# Altium schematic sheet power input.SchDoc
size 431 x 279 mm; SheetNumber: 4; SheetTotal: 5
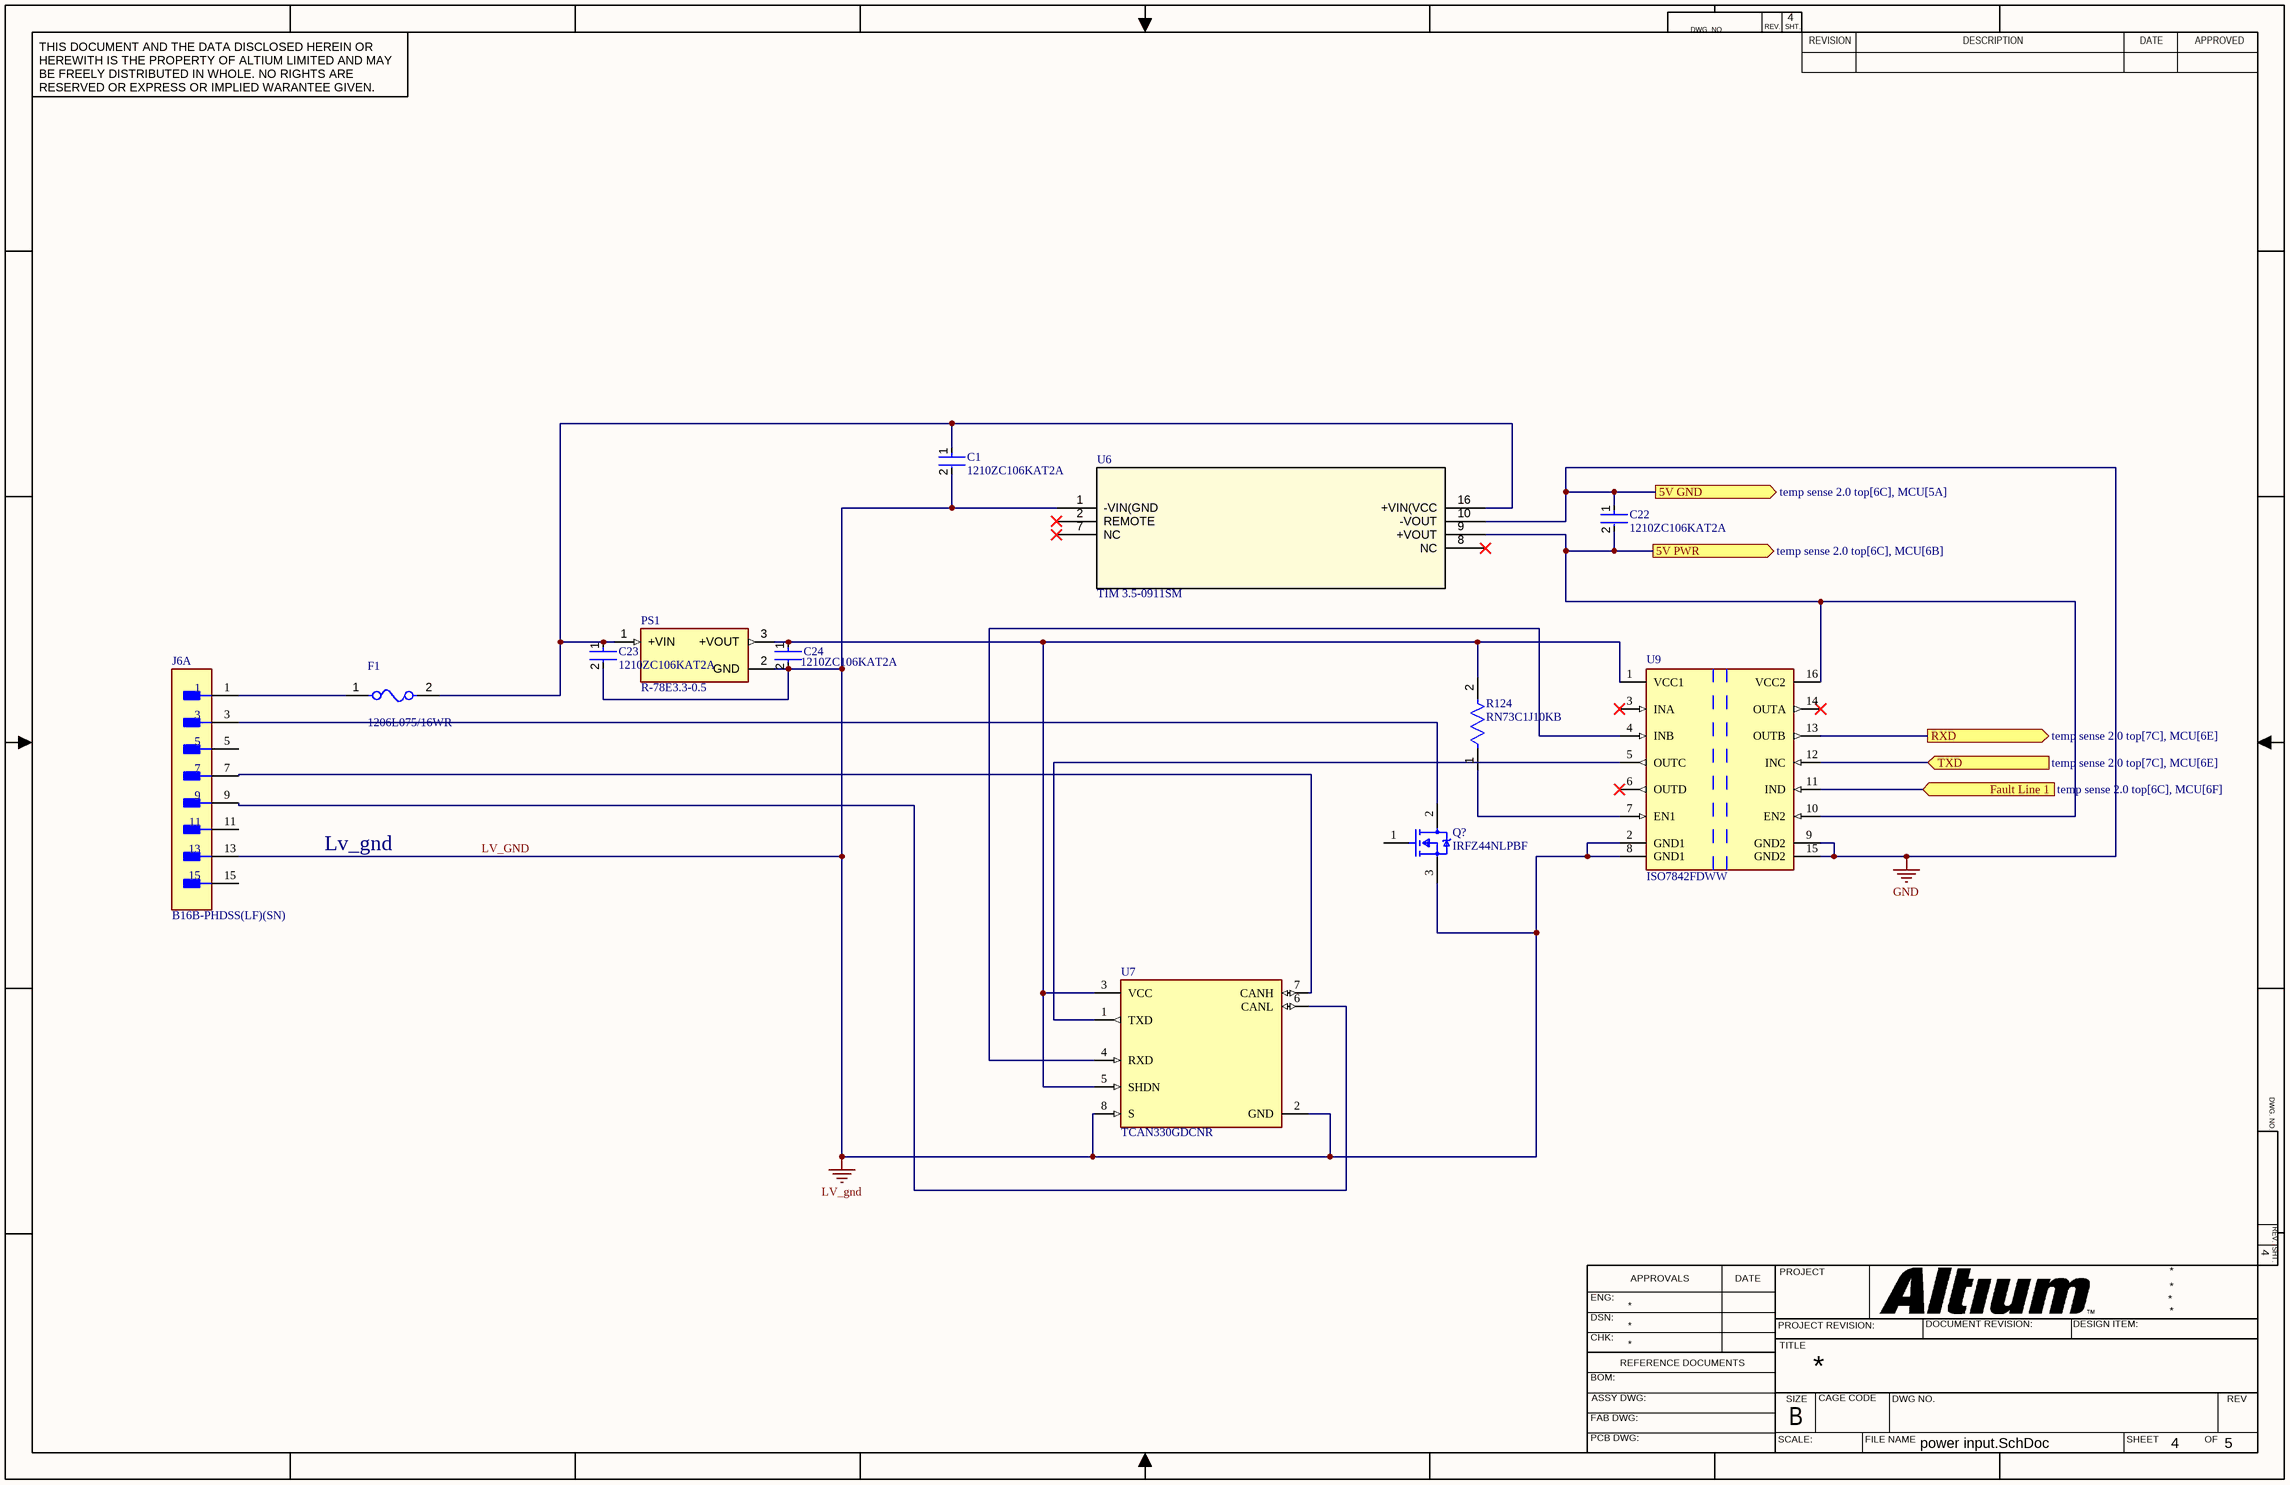
[diagram p0: power input.SchDoc]

## Parts
C1  1210ZC106KAT2A  [FP-1210-L_3_3_0_4-W_2_5_0-IPC_A]
C22  1210ZC106KAT2A  [FP-1210-L_3_3_0_4-W_2_5_0-IPC_A]
C23  1210ZC106KAT2A  [FP-1210-L_3_3_0_4-W_2_5_0-IPC_A]
C24  1210ZC106KAT2A  [FP-1210-L_3_3_0_4-W_2_5_0-IPC_A]
F1  1206L075/16WR  [FP-1206L-MFG]
J6  B16B-PHDSS(LF)(SN)  [FP-B16B-PHDSS_LF_SN-MFG]  (part A of 2)
PS1  R-78E3.3-0.5  [CONV_R-78E3.3-0.5]
Q?  IRFZ44NLPBF  [FP-PG-TO262-3-MFG]
R124  RN73C1J10KB  [FP-RN731J-MFG]
U6  TIM 3.5-0911SM  [TIM 3.5SM SINGLE_TRP]
U7  TCAN330GDCNR  [FP-DCN0008A-MFG]
U9  ISO7842FDWW  [FP-DWW0016A-MFG]

## Ports
5V GND (out, see temp sense 2.0 top[6C], MCU[5A]), 5V PWR (out, see temp sense 2.0 top[6C], MCU[6B]), Fault Line 1 (in, see temp sense 2.0 top[6C], MCU[6F]), RXD (out, see temp sense 2.0 top[7C], MCU[6E]), TXD (in, see temp sense 2.0 top[7C], MCU[6E])

## Nets
GND: C22.1 U6.10(-VOUT) U9.9(GND2) U9.15(GND2) ; port 5V GND
LV_GND: C1.2 C23.2 C24.2 J6.13 PS1.2(GND) Q?.3(S) U6.1(-VIN(GND) U7.2(GND) U7.8(S) U9.2(GND1) U9.8(GND1)
5V PWR: C22.2 U6.9(+VOUT) U9.10(EN2) U9.16(VCC2) ; port 5V PWR
Fault Line 1: U9.11(IND) ; port Fault Line 1
RXD: U9.13(OUTB) ; port RXD
TXD: U9.12(INC) ; port TXD
NetC1_1: C1.1 C23.1 F1.2 PS1.1(+VIN) U6.16(+VIN(VCC)
NetC24_1: C24.1 PS1.3(+VOUT) R124.2 U7.3(VCC) U7.5(SHDN) U9.1(VCC1)
NetF1_1: F1.1 J6.1
NetJ6_3: J6.3 Q?.2(D)
NetJ6_7: J6.7 U7.7(CANH)
NetJ6_9: J6.9 U7.6(CANL)
NetR124_1: R124.1 U9.7(EN1)
NetU7_1: U7.1(TXD) U9.5(OUTC)
NetU7_4: U7.4(RXD) U9.4(INB)

Not connected (* = marked no-connect by the designer): J6 5 11 15; Q? 1(G); U6 2(REMOTE)* 7(NC)* 8(NC)*; U9 3(INA)* 6(OUTD)* 14(OUTA)*

## Notes on the sheet
- Lv_gnd
- DWG. NO.
- REV.
- SHT.
- THIS DOCUMENT AND THE DATA DISCLOSED HEREIN OR HEREWITH IS THE PROPERTY OF ALTIUM LIMITED AND MAY BE FREELY DISTRIBUTED IN WHOLE. NO RIGHTS ARE RESERVED OR EXPRESS OR IMPLIED WARANTEE GIVEN.
- REVISION
- DESCRIPTION
- DATE
- APPROVED
- ENG:
- APPROVALS
- PROJECT
- DSN:
- CHK:
- REFERENCE DOCUMENTS
- PROJECT REVISION:
- TITLE
- DOCUMENT REVISION:
- DESIGN ITEM:
- BOM:
- FAB DWG:
- PCB DWG:
- ASSY DWG:
- SCALE:
- SIZE
- B
- CAGE CODE
- FILE NAME
- DWG NO.
- SHEET
- OF
- REV

## Library data of the parts
C1 C22-C24 = CMP-1038-02198-3: CAP CER 10UF 10V X7R 1210; Dissipation Factor: 5%; Tolerance: 10%; Capacitance: 10uF; Voltage Rating (DC): 10V; Case Code (Imperial): 1210; Termination: SMD/SMT; Min Operating Temperature: -55°C; Max Operating Temperature: 125°C; Voltage: 10V; RoHS Compliant: Yes; Lead Free: Lead Free; Construction: Flat; Case/Package: 1210; Dielectric: X7R; Width: 0.098inch; REACH SVHC: No SVHC; Mount: Surface Mount; Case Code (Metric): 3225; Depth: 2.5mm; Series: 1210; Voltage Rating: 10V; Packaging: Tape and Reel; Length: 3.2mm; Thickness: 0.11inch; Package Quantity: 1; Height: 2.79mm; Radiation Hardening: No
F1 = CMP-08606-000003-1: PTC RESET FUSE 16V 750MA 1206; Manufacturer: Littelfuse Inc; Hold Current: 0.75A; Resistance: 0.09-0.29Ω; Value: 0.09-0.29Ω; Trip Time: 0.2s; Current Rating: 100A; Trip Current: 1.5A; Device Class L2: PTC Resettable Fuses; RoHS: TRUE; Temperature: -40°C to +85°C; ComponentLink2URL: https://www.littelfuse.com/~/media/electronics/datasheets/resettable_ptcs/littelfuse_ptc_1206l_datasheet.pdf.pdf; Voltage Rating: 16V; Category: Fuse; Manufacturer Part Number: 1206L075/16WR; Lead Free: Yes; Digikey Description: PTC RESET FUSE 16V 750MA 1206; Temperature Range Low: -40°C; Temperature Range High: +85°C; Octopart: https://octopart.com/1206l075%2F16wr-littelfuse-28867102; Package: 1206L; Device Class L1: Circuit Protection; Height: 1.25mm; ComponentLink2Description: Datasheet; Automotive: No; Mouser Description: Resettable Fuses - PPTC 16V 0.75A 1206 PTC; Device Class L3: unset
J6 = CMP-17439-000399-1: CONN HEADER VERT 16POS 2MM; Max Current Rating: 3A; Voltage Rating: 250V; Row Spacing: 0.079inch; Number of Contacts: 16; Mated Stacking Heights: 8.8mm; Contact Resistance: 20mR; Gender: Male; Contact Finish - Mating: TIN; Contact Mating Length: 0.114inch; Current Rating: 3A; Connector Type: Header; Insulation Material: Nylon; Packaging: Bulk; Max Voltage Rating (AC): 250V; Depth: 5mm; Number of Rows: 2; Length: 17.9mm; Width: 5mm; Mount: Through Hole; Contact Material: Copper Alloy; Pitch: 2mm; Insulation Color: Natural; Lead Free: Lead Free; Housing Material: Polyamide; Min Operating Temperature: -25°C; Max Operating Temperature: 85°C; Contact Type: Male Pin; Fastening Type: Detent; Height: 9.5mm; Color: Natural; Contact Shape: Square; Housing Color: Beige; Series: PHD; Number of Positions: 16; Orientation: Straight; Flammability Rating: UL94 V-0; Termination: Solder; Contact Plating: Copper
PS1 = R-78E3.3-0.5: 0.5A DC/DC-Converter 'INNOLINE' SIP3 reg; MF: Recom Power; Check_prices: https://www.snapeda.com/parts/R-78E3.3-0.5/Recom+Power/view-part/?ref=eda; Value: *; MP: R-78E3.3-0.5; Purchase-URL: https://pricing.snapeda.com/search/part/R-78E3.3-0.5/?ref=eda; SnapEDA_Link: https://www.snapeda.com/parts/R-78E3.3-0.5/Recom+Power/view-part/?ref=snap; Package: SIP-3 Recom Power; Digi-Key_Part_Number: 945-1661-5-ND
Q? = CMP-00196-65874408-1: IRFZ44NLPBF Single N-Channel 55 V 17.5 mOhm 63 nC HEXFET® Power Mosfet - TO-262; Resistance: 17.5MΩ; Turn-On Delay Time: 12ns; Drain to Source Breakdown Voltage: 55V; Threshold Voltage: 4V; Rise Time: 60ns; Input Capacitance: 1.47nF; Power Dissipation: 110W; Max Junction Temperature (Tj): 175°C; Gate to Source Voltage (Vgs): 20V; Number of Channels: 1; Fall Time: 45ns; Max Power Dissipation: 3.8W; Continuous Drain Current (ID): 49A; Turn-Off Delay Time: 44ns; Case/Package: TO-262; Lifecycle Status: Production; Packaging: Bulk; RoHS: Compliant; Radiation Hardening: No; Height: 9.65mm; Voltage Rating (DC): 55V; On-State Resistance: 17.5mΩ; Width: 4.826mm; Mount: Through Hole; Max Operating Temperature: 175°C; Schedule B: 8541290080, 8541290080; Termination: Through Hole; Dual Supply Voltage: 55V; Package Quantity: 1000; Min Operating Temperature: -55°C; Lead Free: Contains Lead, Lead Free; Drain to Source Voltage (Vdss): 55V; Element Configuration: Single; Length: 10.668mm; Rds On Max: 17.5mΩ; Number of Pins: 3; Current Rating: 49A; REACH SVHC: No SVHC; Drain to Source Resistance: 17.5mΩ; NexarPartId: 65874408; Number of Elements: 1; Nominal Vgs: 4V
R124 = CMP-03211-006130-1: Thin Film Resistors RN 0603 10KΩ 0.1% 10ppm/°C; Manufacturer: TE Connectivity; Voltage Rating: 50V; Power Rating: 0.063W; Octopart: https://octopart.com/rn73c1j10kb-te+connectivity-47108040; RoHS: TRUE; Value: 10KΩ; Device Class L1: Passive Components; Manufacturer Part Number: RN73C1J10KB; ComponentLink2URL: https://www.te.com/commerce/DocumentDelivery/DDEController?Action=showdoc&DocId=Data+Sheet%7F1773270%7FP%7Fpdf%7FEnglish%7FENG_DS_1773270_P.pdf%7F9-1614352-9; Resistance: 10KΩ; Temperature Coefficient: 10ppm/°C; Device Class L2: Resistors; Temperature Range High: +155°C; Temperature: -55°C to +155°C; Series: RN73; Height: 0.55mm; Package: RN731J; octopart_url: https://octopart.com/rn73c1j10kb-te+connectivity-47108040; ComponentLink2Description: Datasheet; Temperature Range Low: -55°C; Composition: Thin Film; Ipc Land Pattern Name: RESC15580X45; Automotive: No; Lead Free: Yes; Device Class L3: Chip SMD Resistors; Category: Res; Tolerance: 0.1%
U6 = CMP-01539-89931857-1: TIM 3.5-0911SM 3.5 Watt DC/DC converter, medical, 4: 1 input, 5000 VAC I/O-isolation (2 x MOPP), low leakage current, encapsulated,...; Output Power: 3.5W; Number of Outputs: 1; NexarPartId: 89931857; Height: 10.5mm; Width: 14.4mm; RoHS: Compliant
U7 = CMP-04872-000178-1: IC TRANSCEIVER 1/1 SOT23-8; Data Rate: 1Mbps; Packaging: Tape and Reel; Min Operating Temperature: -40°C; Max Operating Temperature: 125°C; RoHS Compliant: Yes; Lead Free: Lead Free; Case/Package: SOT-23-8; Mount: Surface Mount
U9 = CMP-04872-000209-1: DGTL ISO 5700VRMS 4CH GP 16SOIC; Min Supply Voltage: 2.25V; Pulse Width Distortion (PWD): 4.1ns; Channel Type: Unidirectional; Number of Channels: 4; Max Supply Voltage: 5.5V; Isolated Power: No; Propagation Delay: 16ns; Data Rate: 100Mbps; Type: General Purpose; Packaging: Rail/Tube; REACH SVHC: No SVHC; Number of Pins: 16; Max Operating Temperature: 125°C; Case/Package: SOIC; RoHS Compliant: Yes; Min Operating Temperature: -55°C; Lead Free: Lead Free